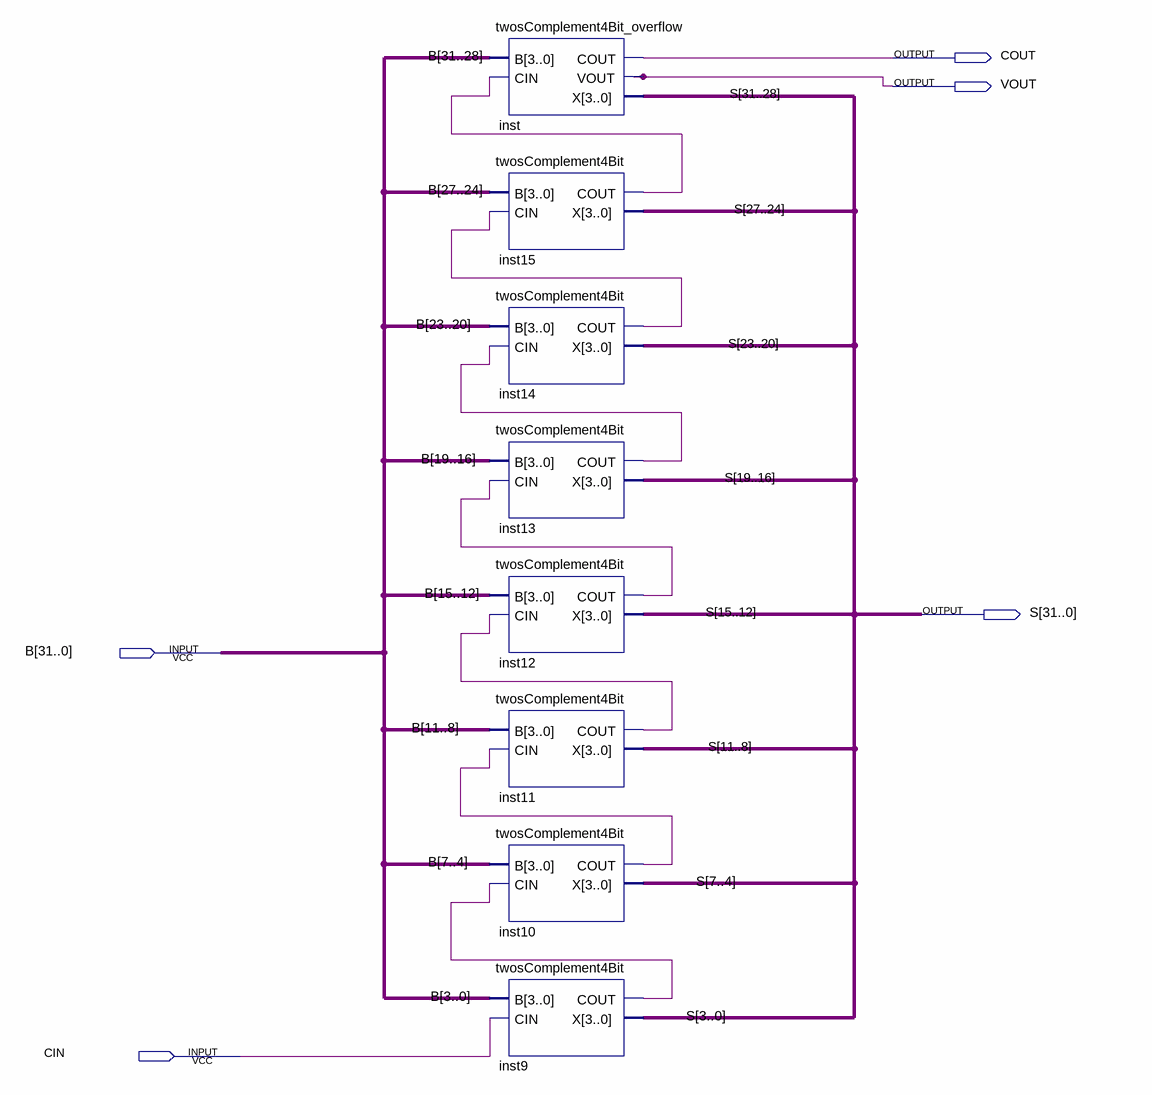
[diagram p0: schematic sheet]
// Quartus schematic twosComplement32Bit.bdf as structural Verilog: 8 symbols, 5 pins
module twosComplement32Bit (
  input  [31:0] B,
  input  CIN,
  output COUT,
  output VOUT,
  output [31:0] S
);

  wire inst9_cout, inst10_cout, inst11_cout, inst12_cout, inst13_cout, inst14_cout, inst15_cout;

  twosComplement4Bit_overflow inst (.B(B[31:28]), .CIN(inst15_cout), .COUT(COUT), .VOUT(VOUT), .X(S[31:28]));
  twosComplement4Bit inst15 (.B(B[27:24]), .CIN(inst14_cout), .COUT(inst15_cout), .X(S[27:24]));
  twosComplement4Bit inst14 (.B(B[23:20]), .CIN(inst13_cout), .COUT(inst14_cout), .X(S[23:20]));
  twosComplement4Bit inst13 (.B(B[19:16]), .CIN(inst12_cout), .COUT(inst13_cout), .X(S[19:16]));
  twosComplement4Bit inst12 (.B(B[15:12]), .CIN(inst11_cout), .COUT(inst12_cout), .X(S[15:12]));
  twosComplement4Bit inst11 (.B(B[11:8]), .CIN(inst10_cout), .COUT(inst11_cout), .X(S[11:8]));
  twosComplement4Bit inst10 (.B(B[7:4]), .CIN(inst9_cout), .COUT(inst10_cout), .X(S[7:4]));
  twosComplement4Bit inst9 (.B(B[3:0]), .CIN(CIN), .COUT(inst9_cout), .X(S[3:0]));
endmodule
